# EAGLE design power-ctl (EAGLE 6.1)
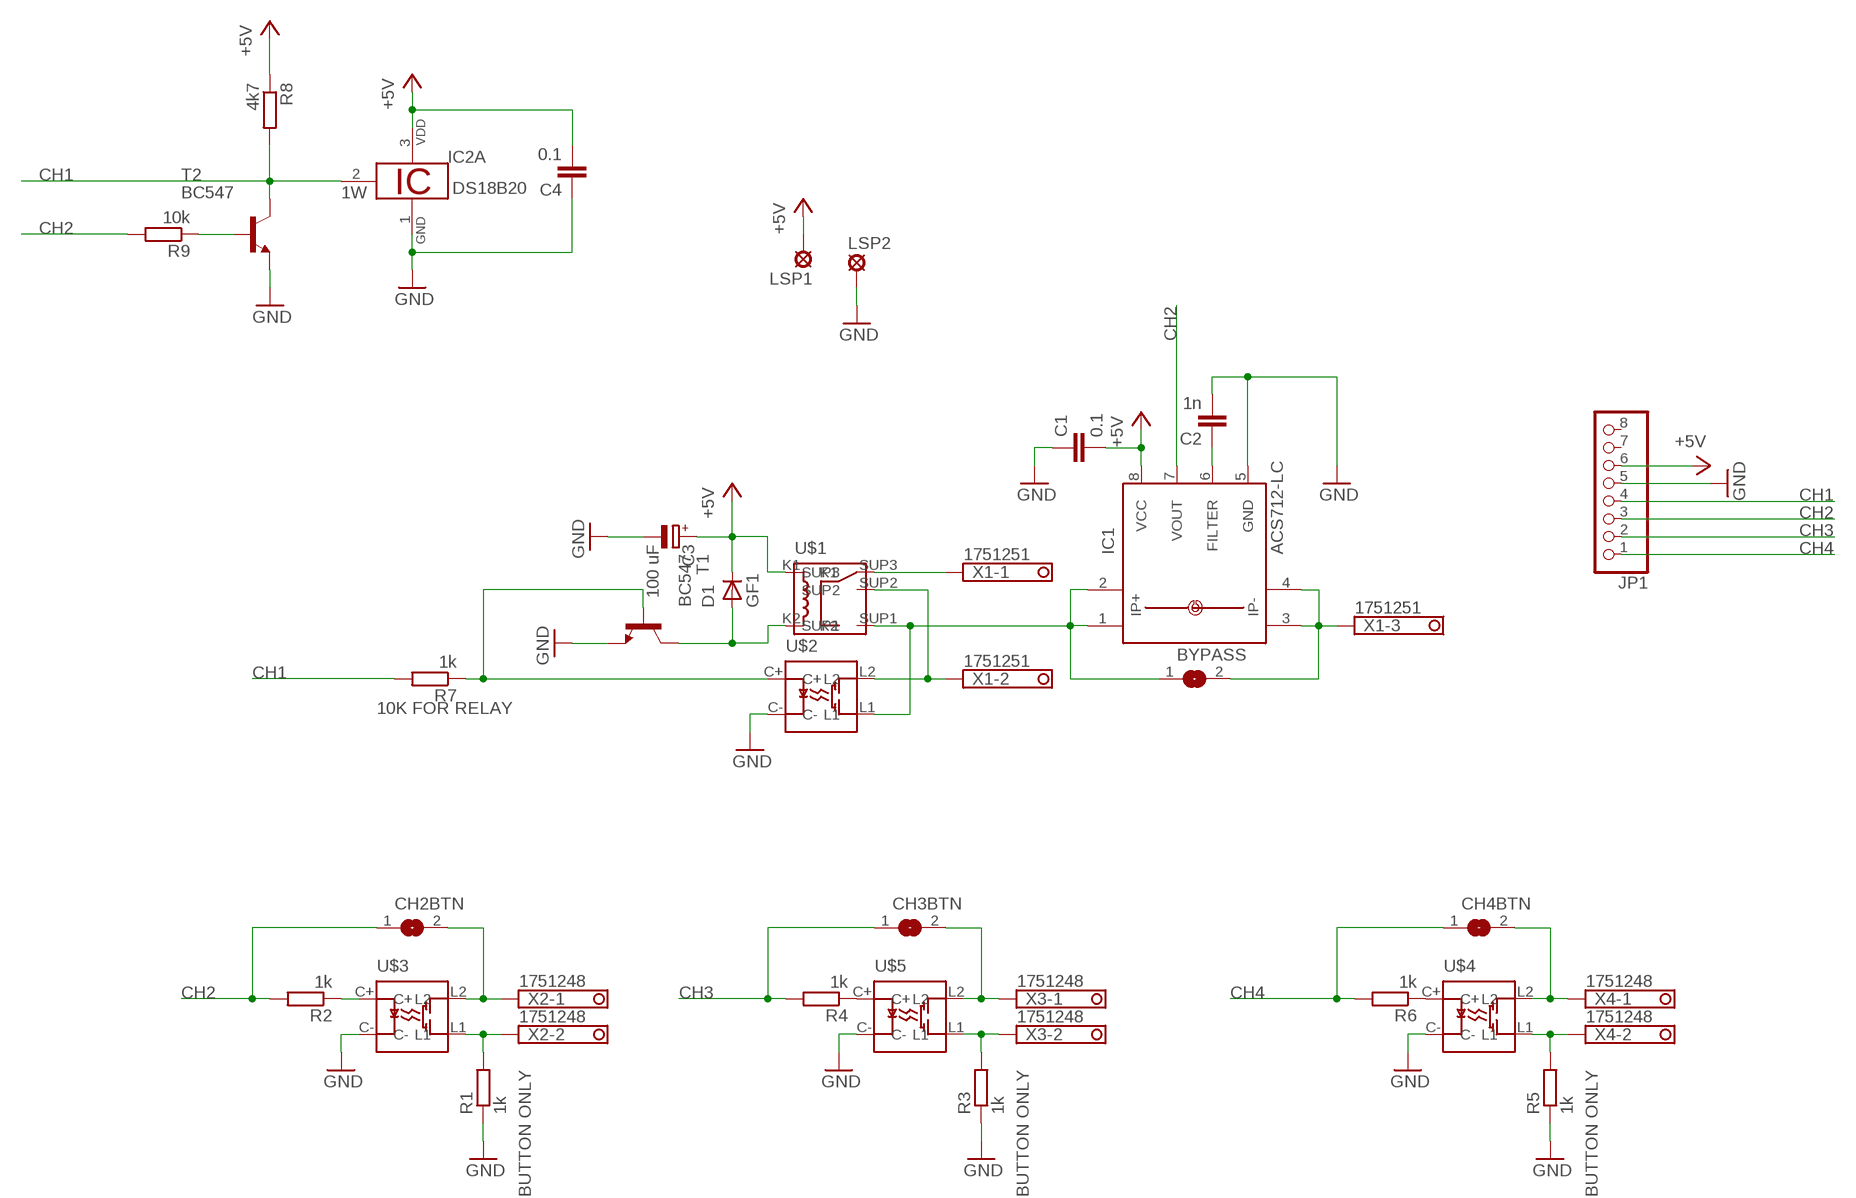
[diagram p0: schematic, sheet 1]

## Parts
BYPASS  SJ  [SJ]
C1  0.1  C-EUC0805  [C0805]
C2  1n  C-EUC0805  [C0805]
C3  100 uF  CPOL-EUE2-4  [E2-4]
C4  0.1  C-EUC0805  [C0805]
CH2BTN  SJ  [SJ]
CH3BTN  SJ  [SJ]
CH4BTN  SJ  [SJ]
D1  GF1  [SMA-DO214AC]
IC1  ACS712-LC  [SOIC8]
IC2  DS18B20  [TO92-]
JP1  PINHD-1X8/90  [1X08/90]
LSP1  LSP10  [LSP10]
LSP2  LSP10  [LSP10]
R1  1k  R-EU_M0805  [M0805]
R2  1k  R-EU_M0805  [M0805]
R3  1k  R-EU_M0805  [M0805]
R4  1k  R-EU_M0805  [M0805]
R5  1k  R-EU_M0805  [M0805]
R6  1k  R-EU_M0805  [M0805]
R7  1k  R-EU_M0805  [M0805]
R8  4k7  R-EU_M0805  [M0805]
R9  10k  R-EU_M0805  [M0805]
T1  BC547  [TO92]
T2  BC547  [TO92]
U$1  TRV-5VDC-SC-CD  [TRV-5VDC-SC-CD]
U$2  CPC1030N  [SOP4]
U$3  CPC1030N  [SOP4]
U$4  CPC1030N  [SOP4]
U$5  CPC1030N  [SOP4]
X1  1751251  [1751251]
X2  1751248  [1751248]
X3  1751248  [1751248]
X4  1751248  [1751248]

## Nets
+5V: C1.2 C3.+ C4.2 D1.K(C) IC1.8(VCC) IC2.3 JP1.6 LSP1.MP R8.1 U$1.K1
CH1: IC2.2 JP1.4 R7.2 R8.2 T2.3(C)
CH2: CH2BTN.1 IC1.7(VOUT) JP1.3 R2.2 R9.2
CH3: CH3BTN.1 JP1.2 R4.2
CH4: CH4BTN.1 JP1.1 R6.2
GND: C1.1 C2.2 C3.- C4.1 IC1.5(GND) IC2.1 JP1.5 LSP2.MP R1.1 R3.1 R5.1 T1.1(E) T2.1(E) U$2.C- U$3.C- U$4.C- U$5.C-
N$1: BYPASS.2 IC1.3(IP-) IC1.4(IP-1) X1.3
N$2: BYPASS.1 IC1.1(IP+) IC1.2(IP+1) U$1.SUP1 U$2.L1
N$3: R1.2 U$3.L1 X2.2
N$4: CH2BTN.2 U$3.L2 X2.1
N$5: R2.1 U$3.C+
N$6: R3.2 U$5.L1 X3.2
N$7: CH3BTN.2 U$5.L2 X3.1
N$8: CH4BTN.2 U$4.L2 X4.1
N$9: R5.2 U$4.L1 X4.2
N$10: R4.1 U$5.C+
N$11: R6.1 U$4.C+
N$12: C2.1 IC1.6(FILTER)
N$13: D1.A T1.3(C) U$1.K2
N$14: U$1.SUP2 U$2.L2 X1.2
N$16: R7.1 T1.2(B) U$2.C+
N$17: U$1.SUP3 X1.1
N$19: R9.1 T2.2(B)
Unconnected: JP1.7 JP1.8

## Notes on the sheet
- 10K FOR RELAY
- BUTTON ONLY | BUTTON ONLY | BUTTON ONLY

## Library data of the parts
BYPASS CH2BTN CH3BTN CH4BTN = jumper:SJ: SMD solder JUMPER
C1 C2 C4 = rcl:C-EU: CAPACITOR, European symbol
C3 = rcl:CPOL-EU: POLARIZED CAPACITOR, European symbol
D1 = diode:GF1: DIODE
IC1 = allegro-2:ACS712-LC
IC2 = ds18b20:DS18B20: Programmable Resolution Digital Thermometer This chip provides a onewire thermosensor with approx. 0.5°C accuracy. A programmable over/undertemperure alarm is available. The precision can be set from 9..12 bits. Notes: Vdd must be applied for accurate measurements at low temperatures, as the parasite power circuit otherwise heats the sensor. If parasite power is used, Vdd has to be connected to GND. The DS1822 is a low-cost thermometer chip, the DS18S20 is similar to the DS18B20, but with 9 Bit precision only. Author: Jan Kandziora <jjj@gmx.de>
JP1 = pinhead:PINHD-1X8: PIN HEADER
LSP1 LSP2 = solpad:LSP10: SOLDER PAD drill 1.0 mm, distributor Buerklin, 12H555
R1-R9 = rcl:R-EU_: RESISTOR, European symbol
T1 T2 = transistor:BC547: NPN TRANSISTOR
U$1 = relay-trv:TRV-5VDC-SC-CD
U$2-U$5 = cpc1030n:CPC1030N: http://www.elitan.ru/price/item262623
X1 = con-phoenix-350:1751251: MKDS 1/ 3-3,5 Printklemme Nennstrom: 10 A Bemessungsspannung: 160 V Raster: 3,5 mm Polzahl: 3 Montageart: Löten Anschlussart: Schraubanschluss Anschlussrichtung vom Leiter zur Platine: 0° Source: http://eshop.phoenixcontact.com .. 1751251.pdf; OC_FARNELL: unknown; OC_NEWARK: unknown
X2-X4 = con-phoenix-350:1751248: MKDS 1/ 2-3,5 Printklemme Nennstrom: 10 A Bemessungsspannung: 160 V Raster: 3,5 mm Polzahl: 2 Montageart: Löten Anschlussart: Schraubanschluss Anschlussrichtung vom Leiter zur Platine: 0° Source: http://eshop.phoenixcontact.com .. 1751248.pdf; OC_FARNELL: unknown; OC_NEWARK: unknown

## Board
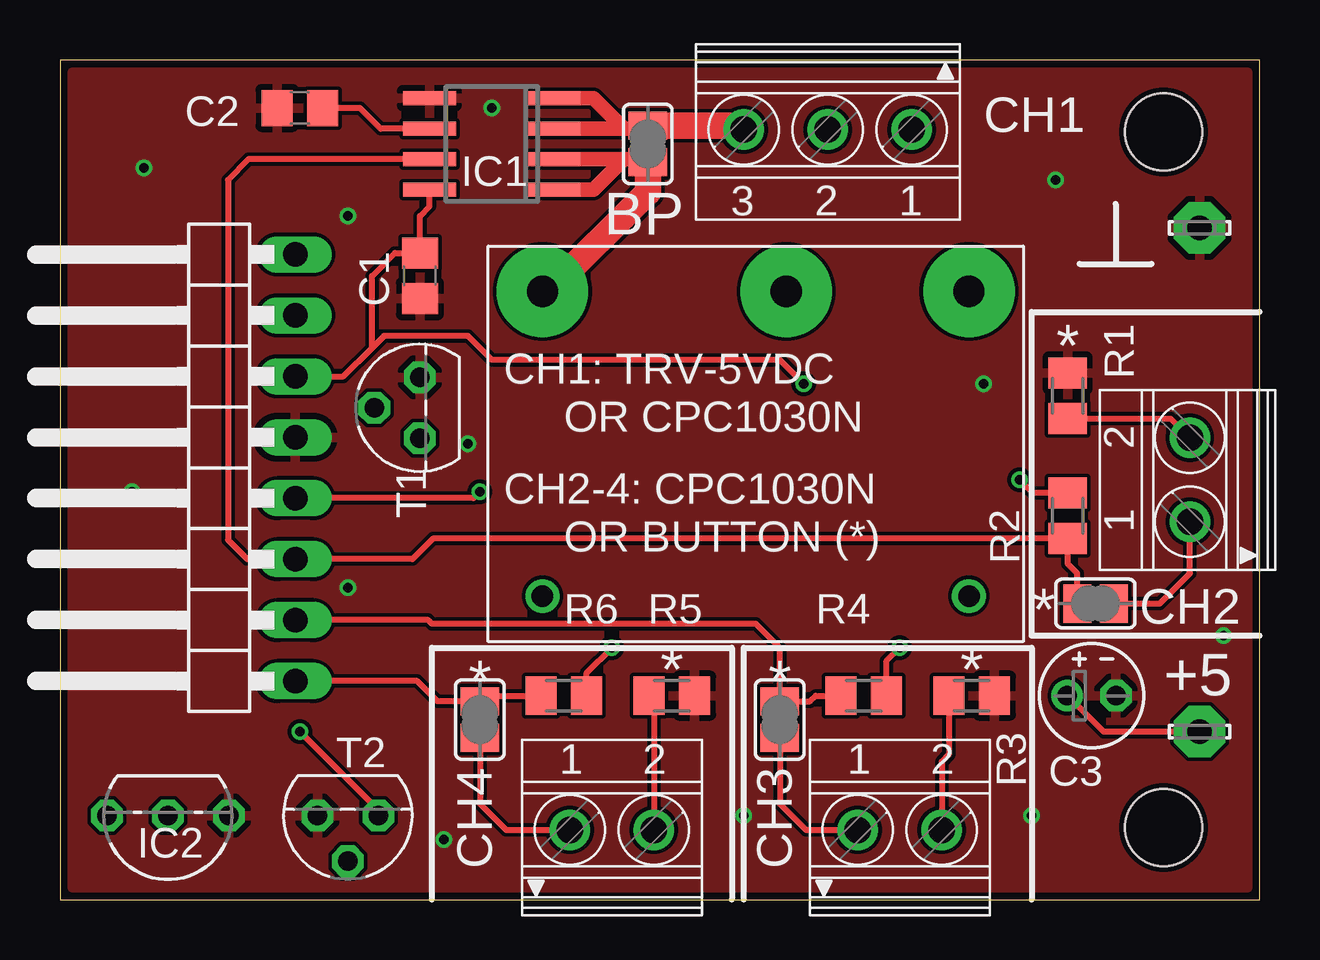
[diagram p1: board, top side]
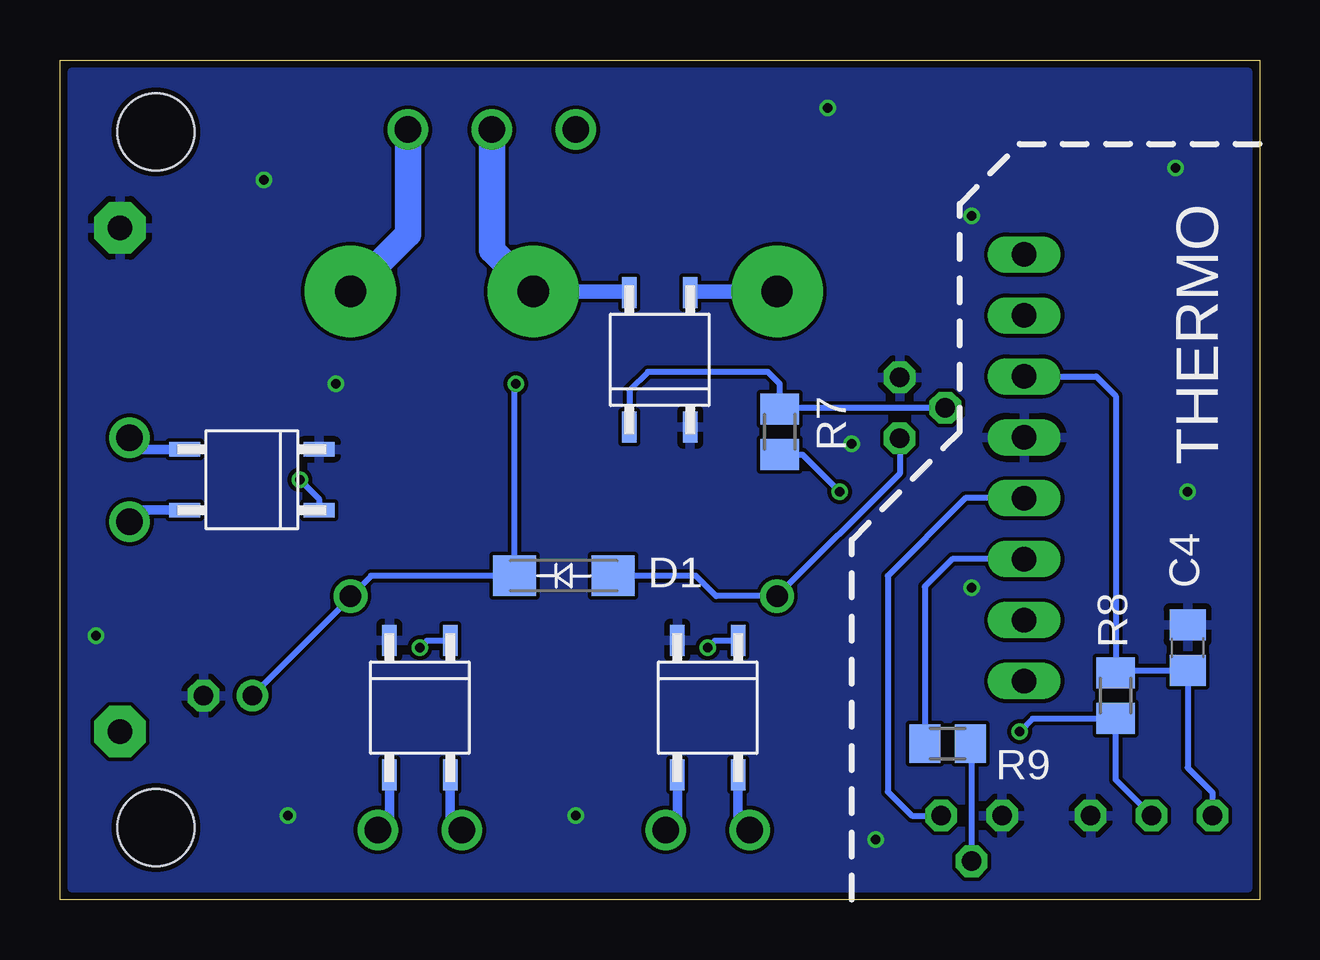
[diagram p2: board, bottom side, seen from below]

Size 50 x 35 mm. Coordinates in mm from the lower left corner, seen from the top.
Outline: 0,0 50,0 50,35 0,35 0,0
Copper layers (1*16): Top 0.035mm / dielectric 1.5mm / Bottom 0.035mm
Design rules: minimum track width 6mil, minimum drill 12mil, track to track 6mil, track to pad 6mil, pad to pad 6mil, via to via 6mil, smd to smd 0mil, copper to edge 10mil, drill to drill 10mil, minimum pad ring 10mil, minimum via ring 6mil, stop-mask expansion 2mil, vias tented up to drill 100mil, thermal gap 10mil
Holes 3.2 mm at 46,3 46,32

### Footprints (pad centres in the part's own frame; a part is rotated, then mirrored left to right if it is on the bottom)
SJ = smd 1.168 x 1.6: 1 -0.762,0; 2 0.762,0
C0805 = smd 1.3 x 1.5: 1 -0.95,0; 2 0.95,0
E2-4 = drill 0.813 pad 1.27: + -1.016,0 | drill 0.813 pad 1.27 octagon: - 1.016,0
SMA-DO214AC = smd 1.8 x 1.7: A -2.05,0; K 2.05,0
SOIC8 = smd 0.6 x 2.2: 1 -1.905,-2.6; 2 -0.635,-2.6; 3 0.635,-2.6; 4 1.905,-2.6; 5 1.905,2.6; 6 0.635,2.6; 7 -0.635,2.6; 8 -1.905,2.6
TO92- = drill 0.813 octagon: 1 -2.54,0; 2 0,0; 3 2.54,0
1X08/90 = drill 1.016 long: 1 -8.89,-3.81; 2 -6.35,-3.81; 3 -3.81,-3.81; 4 -1.27,-3.81; 5 1.27,-3.81; 6 3.81,-3.81; 7 6.35,-3.81; 8 8.89,-3.81
LSP10 = drill 1.016 pad 2.159 octagon: MP 0,0
M0805 = smd 1.3 x 1.6: 1 -0.95,0; 2 0.95,0
TO92 = drill 0.813 octagon: 1 1.27,0; 2 0,1.905; 3 -1.27,0
TRV-5VDC-SC-CD = drill 0.9: K1 -8.89,6.35; K2 8.89,6.35 | drill 1.3 pad 3.81: SUP1 8.89,-6.35; SUP2 -1.27,-6.35; SUP3 -8.89,-6.35
SOP4 = smd 0.6 x 1.3: C+ -1.27,-2.8; C- 1.27,-2.8; L1 1.27,2.8; L2 -1.27,2.8
1751251 = drill 1.1 pad 1.7: 1 -3.5,-0.1; 2 0,-0.1; 3 3.5,-0.1
1751248 = drill 1.1 pad 1.7: 1 -1.75,-0.1; 2 1.75,-0.1

### Placement (x,y rotation side)
BYPASS  24.5,31.5 90 top
C1  15,26 90 top
C2  10,33 180 top
C3  43,8.5 0 top
C4  3,10.5 270 bottom
CH2BTN  43.16,12.34 0 top
CH3BTN  30,7.5 270 top
CH4BTN  17.5,7.5 270 top
D1  29,13.5 180 bottom
IC1  18,31.5 90 top
IC2  4.5,3.5 180 top
JP1  6,18 90 top
LSP1  47.5,7 0 top
LSP2  47.5,28 0 top
R1  42,21 270 top
R2  42,16 270 top
R3  38,8.5 180 top
R4  33.5,8.5 180 top
R5  25.5,8.5 180 top
R6  21,8.5 180 top
R7  20,19.5 270 bottom
R8  6,8.5 270 bottom
R9  13,6.5 180 bottom
T1  15,20.5 90 top
T2  12,3.5 180 top
U$1  29,19 180 top
U$2  25,22.5 0 bottom
U$3  42,17.5 90 bottom
U$4  23,8 180 bottom
U$5  35,8 180 bottom
X1  32,32 180 top
X2  47,17.5 90 top
X3  35,3 0 top
X4  23,3 0 top

### Tracks (layer width: path | path; a pad name or v marks a point on that pad's centre or on a via)
+5V  (via drill 0.4)
  Top 0.25: IC1.8 15.4,28.9 15,28.5 C1.2 13.95,26.95 13,26 13,23 | JP1.6 11.81,21.81 13,23 | v31,21.5 30,22.5 18,22.5 17,23.5 13.5,23.5 13,23 | LSP1.MP 43.5,7 42,8.5 C3.+
  Bottom 0.25: JP1.6 6.81,21.81 6,21 R8.1 5.9,9.55 C4.2 3,5.5 1.96,4.46 IC2.3 | C3.+ 37.89,12.59 U$1.K1 37.04,13.5 D1.K 31.05,21.45 v31,21.5
CH1  (via drill 0.4)
  Top 0.25: T2.3 13.27,3.73 v10,7 | v17.5,17 17.23,16.73 JP1.4
  Bottom 0.25: v10,7 9.45,7.55 R8.2 6,5 IC2.2 | JP1.4 12.27,16.73 15.5,13.5 15.5,4.5 14.5,3.5 T2.3 | R7.2 19.05,18.55 v17.5,17
CH2
  Top 0.25: IC1.7 7.87,30.86 7,30 7,15 7.81,14.19 JP1.3 14.69,14.19 15.55,15.05 R2.2 42,14 42.4,13.6 CH2BTN.1
  Bottom 0.25: JP1.3 12.81,14.19 13.95,13.05 R9.2
CH3
  Top 0.25: JP1.2 15.35,11.65 15.5,11.5 29,11.5 30,10.5 CH3BTN.1 31.26,8.26 31.5,8.5 R4.2
CH4
  Top 0.25: JP1.1 14.89,9.11 15.74,8.26 CH4BTN.1 17.74,8.5 R6.2
GND  (via drill 0.4)
  other vias: 18,33 41.5,30 38.5,21.5 17,19 12,28.5 3.5,30.5 12,13 40.5,3.5 28.5,3.5 16,2.5 48.5,11 3,17
  pour Bottom: 0.5,34.5 49.5,34.5 49.5,0.5 0.5,0.5
  pour Top: 0.5,34.5 49.5,34.5 49.5,0.5 0.5,0.5
N$1
  Top 0.6: BYPASS.2 24.37,32.13 23.5,32.13 | 23.5,32.13 IC1.3 | IC1.4 22.23,33.41 23.5,32.13
  Top 1.1: X1.3 28.34,32.26 BYPASS.2
N$2
  Top 0.6: BYPASS.1 24.37,30.86 23.5,30.86 | 23.5,30.86 IC1.2 | IC1.1 22.23,29.59 23.5,30.86
  Top 1.1: U$1.SUP1 20.35,25.35 24.5,29.5 BYPASS.1
  Bottom 0.6: U$2.L1 23.68,25.35 U$1.SUP1
N$3
  Top 0.25: R1.2 46.3,20.05 X2.2
  Bottom 0.4: U$3.L1 46.62,18.77 X2.2
N$4
  Top 0.25: CH2BTN.2 45.84,12.34 47.1,13.6 X2.1
  Bottom 0.4: U$3.L2 46.62,16.23 X2.1
N$5  (via drill 0.4)
  Top 0.25: R2.1 40.55,16.95 v40,17.5
  Bottom 0.25: v40,17.5 39.2,16.7 U$3.C+
N$6
  Top 0.25: R3.2 37.05,6.05 36.75,5.75 X3.2
  Bottom 0.4: U$5.L1 36.27,3.38 X3.2
N$7
  Top 0.25: CH3BTN.2 30,4 31.1,2.9 X3.1
  Bottom 0.4: U$5.L2 33.73,3.38 X3.1
N$8
  Top 0.25: CH4BTN.2 17.5,4 18.6,2.9 X4.1
  Bottom 0.4: U$4.L2 21.73,3.38 X4.1
N$9
  Top 0.25: R5.2 24.75,8.3 X4.2
  Bottom 0.4: U$4.L1 24.27,3.38 X4.2
N$10  (via drill 0.4)
  Top 0.25: R4.1 34.45,9.95 v35,10.5
  Bottom 0.25: v35,10.5 34.7,10.8 U$5.C+
N$11  (via drill 0.4)
  Top 0.25: R6.1 21.95,9.45 v23,10.5
  Bottom 0.25: v23,10.5 22.7,10.8 U$4.C+
N$12
  Top 0.25: IC1.6 13.37,32.13 12.5,33 C2.1
N$13
  Bottom 0.25: T1.3 15,17.76 U$1.K2 22.65,12.65 23.5,13.5 D1.A
N$14
  Bottom 0.6: U$2.L2 26.32,25.35 U$1.SUP2
  Bottom 1.1: U$1.SUP2 32,27.08 X1.2
N$16
  Bottom 0.25: T1.2 19.95,20.5 R7.1 20,21.5 20.5,22 25.5,22 26.27,21.23 U$2.C+
N$17
  Bottom 1.1: U$1.SUP3 35.5,27.74 X1.1
N$19
  Bottom 0.25: T2.2 12,6.45 R9.1

### Text on the board
tNames: CH1 | BP | * | CH1: TRV-5VDC | OR CPC1030N | CH2-4: CPC1030N | OR BUTTON (*) | * | CH2 | * | * | * | * | +5 | CH4 | CH3
bNames: THERMO